# Altium schematic sheet eMMCModule.SchDoc
size A; SheetNumber: 13; SheetTotal: 14
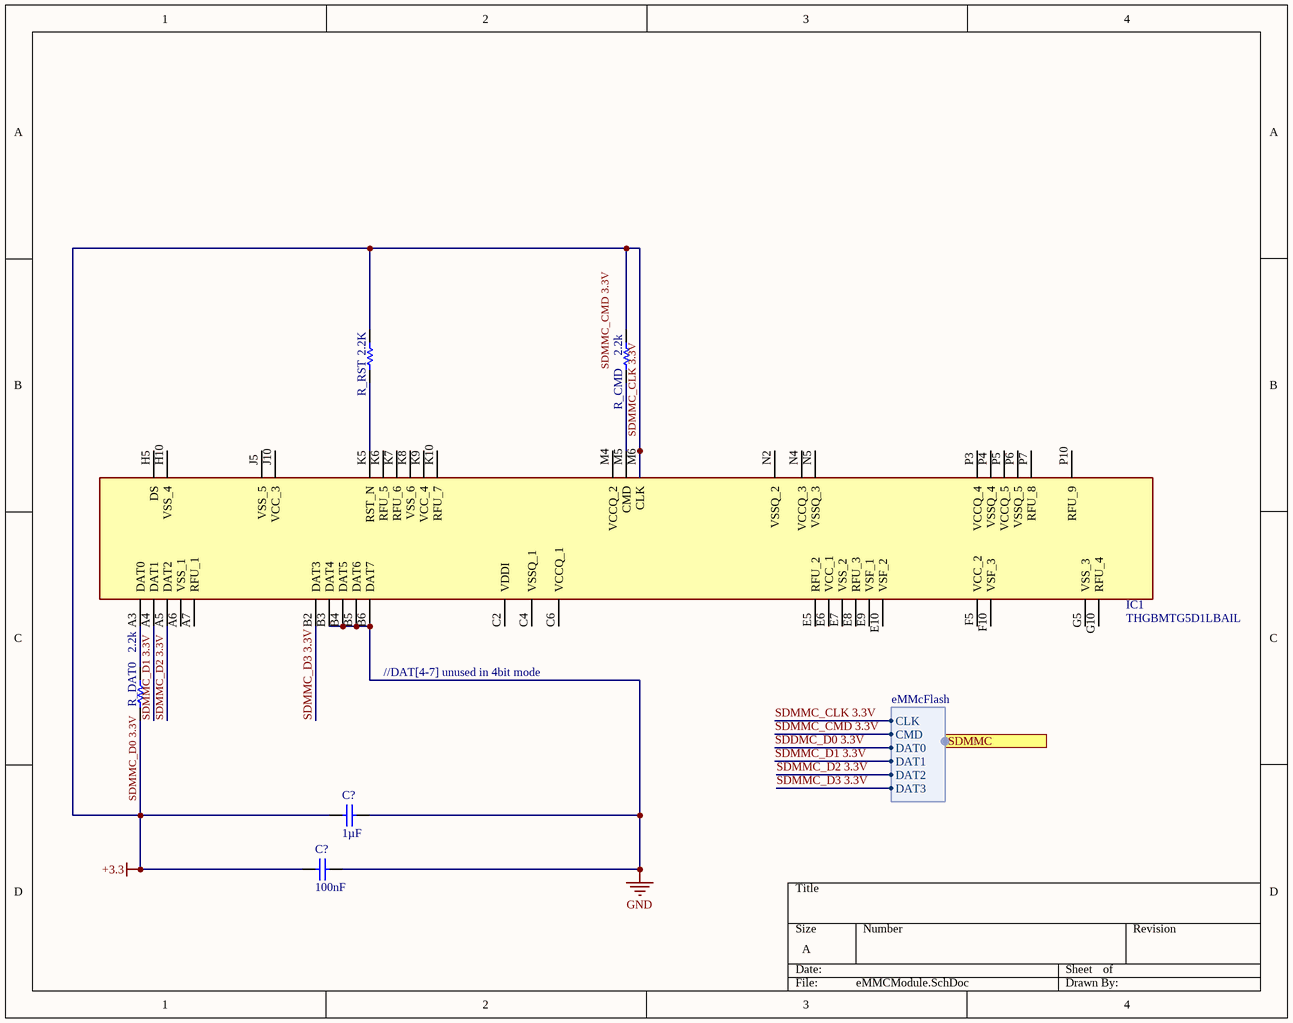
[diagram p0: eMMCModule.SchDoc]

## Parts
(Parts that share a designator on the sheet are numbered #1, #2 ... from top to bottom, then left to right.)
C?#1  value 1µF  (hidden comment: Capacitor)
C?#2  value 100nF  (hidden comment: Capacitor)
IC1  THGBMTG5D1LBAIL  [BGA153C50P14X14_1150X1300X80]
R_CMD  value 2.2k  (hidden comment: Resistor)
R_DAT0  R_DAT0: 2.2k  (hidden comment: Resistor)
R_RST  value 2.2K  (hidden comment: Resistor)

## Ports
SDMMC (harness eMMcFlash)

## Harnesses
eMMcFlash: CLK, CMD, DAT0, DAT1, DAT2, DAT3

## Nets
GND: C?#1.2 C?#2.2 IC1.B3(DAT4) IC1.B4(DAT5) IC1.B5(DAT6) IC1.B6(DAT7)
SDMMC_CLK 3.3V: C?#1.1 C?#2.1 IC1.M6(CLK) R_CMD.2 R_DAT0.1 R_RST.2 ; port SDMMC.CLK  [also labelled +3.3, SDMMC_D0 3.3V]
SDDMC_D0 3.3V: port SDMMC.DAT0
SDMMC_CMD 3.3V: port SDMMC.CMD
SDMMC_D1 3.3V: IC1.A4(DAT1) ; port SDMMC.DAT1
SDMMC_D2 3.3V: IC1.A5(DAT2) ; port SDMMC.DAT2
SDMMC_D3 3.3V: IC1.B2(DAT3) ; port SDMMC.DAT3
NetIC1_A3: IC1.A3(DAT0) R_DAT0.2
NetIC1_K5: IC1.K5(RST_N) R_RST.1
NetIC1_M5: IC1.M5(CMD) R_CMD.1

Not connected (* = marked no-connect by the designer): IC1 A6(VSS_1) A7(RFU_1) C2(VDDI) C4(VSSQ_1) C6(VCCQ_1) E5(RFU_2) E6(VCC_1) E7(VSS_2) E8(RFU_3) E9(VSF_1) E10(VSF_2) F5(VCC_2) F10(VSF_3) G5(VSS_3) G10(RFU_4) H5(DS) H10(VSS_4) J5(VSS_5) J10(VCC_3) K6(RFU_5) K7(RFU_6) K8(VSS_6) K9(VCC_4) K10(RFU_7) M4(VCCQ_2) N2(VSSQ_2) N4(VCCQ_3) N5(VSSQ_3) P3(VCCQ_4) P4(VSSQ_4) P5(VCCQ_5) P6(VSSQ_5) P7(RFU_8) P10(RFU_9)

## Notes on the sheet
- //DAT[4-7] unused in 4bit mode
- Labels drawn without touching a wire or pin: SDMMC_CMD 3.3V

## Library data of the parts
C?#1 C?#2 = Capacitor: SimulationGenericComponent: True
IC1 = THGBMTG5D1LBAIL: Integrated Circuit; Manufacturer_Name: KIOXIA Corporation; Datasheet Link: https://static6.arrow.com/aropdfconversion/5b79d7e5222d5200711a0ed1082b7aa51b6d9eb4/xia_thgbmtg5d1lbail15nm4gbe-mmcver5.0_e_rev.1.0_20211007.pdf; Height: 0.8mm; Manufacturer_Part_Number: THGBMTG5D1LBAIL; Mouser Part Number: 757-THGBMTG5D1LBAIL; Mouser Price/Stock: https://www.mouser.co.uk/ProductDetail/Kioxia-America/THGBMTG5D1LBAIL?qs=Znm5pLBrcAKPRFVhV%252B0AbQ%3D%3D; Arrow Part Number: THGBMTG5D1LBAIL; Arrow Price/Stock: null?region=nac
R_CMD R_DAT0 R_RST = Resistor: TC1: 0; SimulationGenericComponent: True; TC2: 0